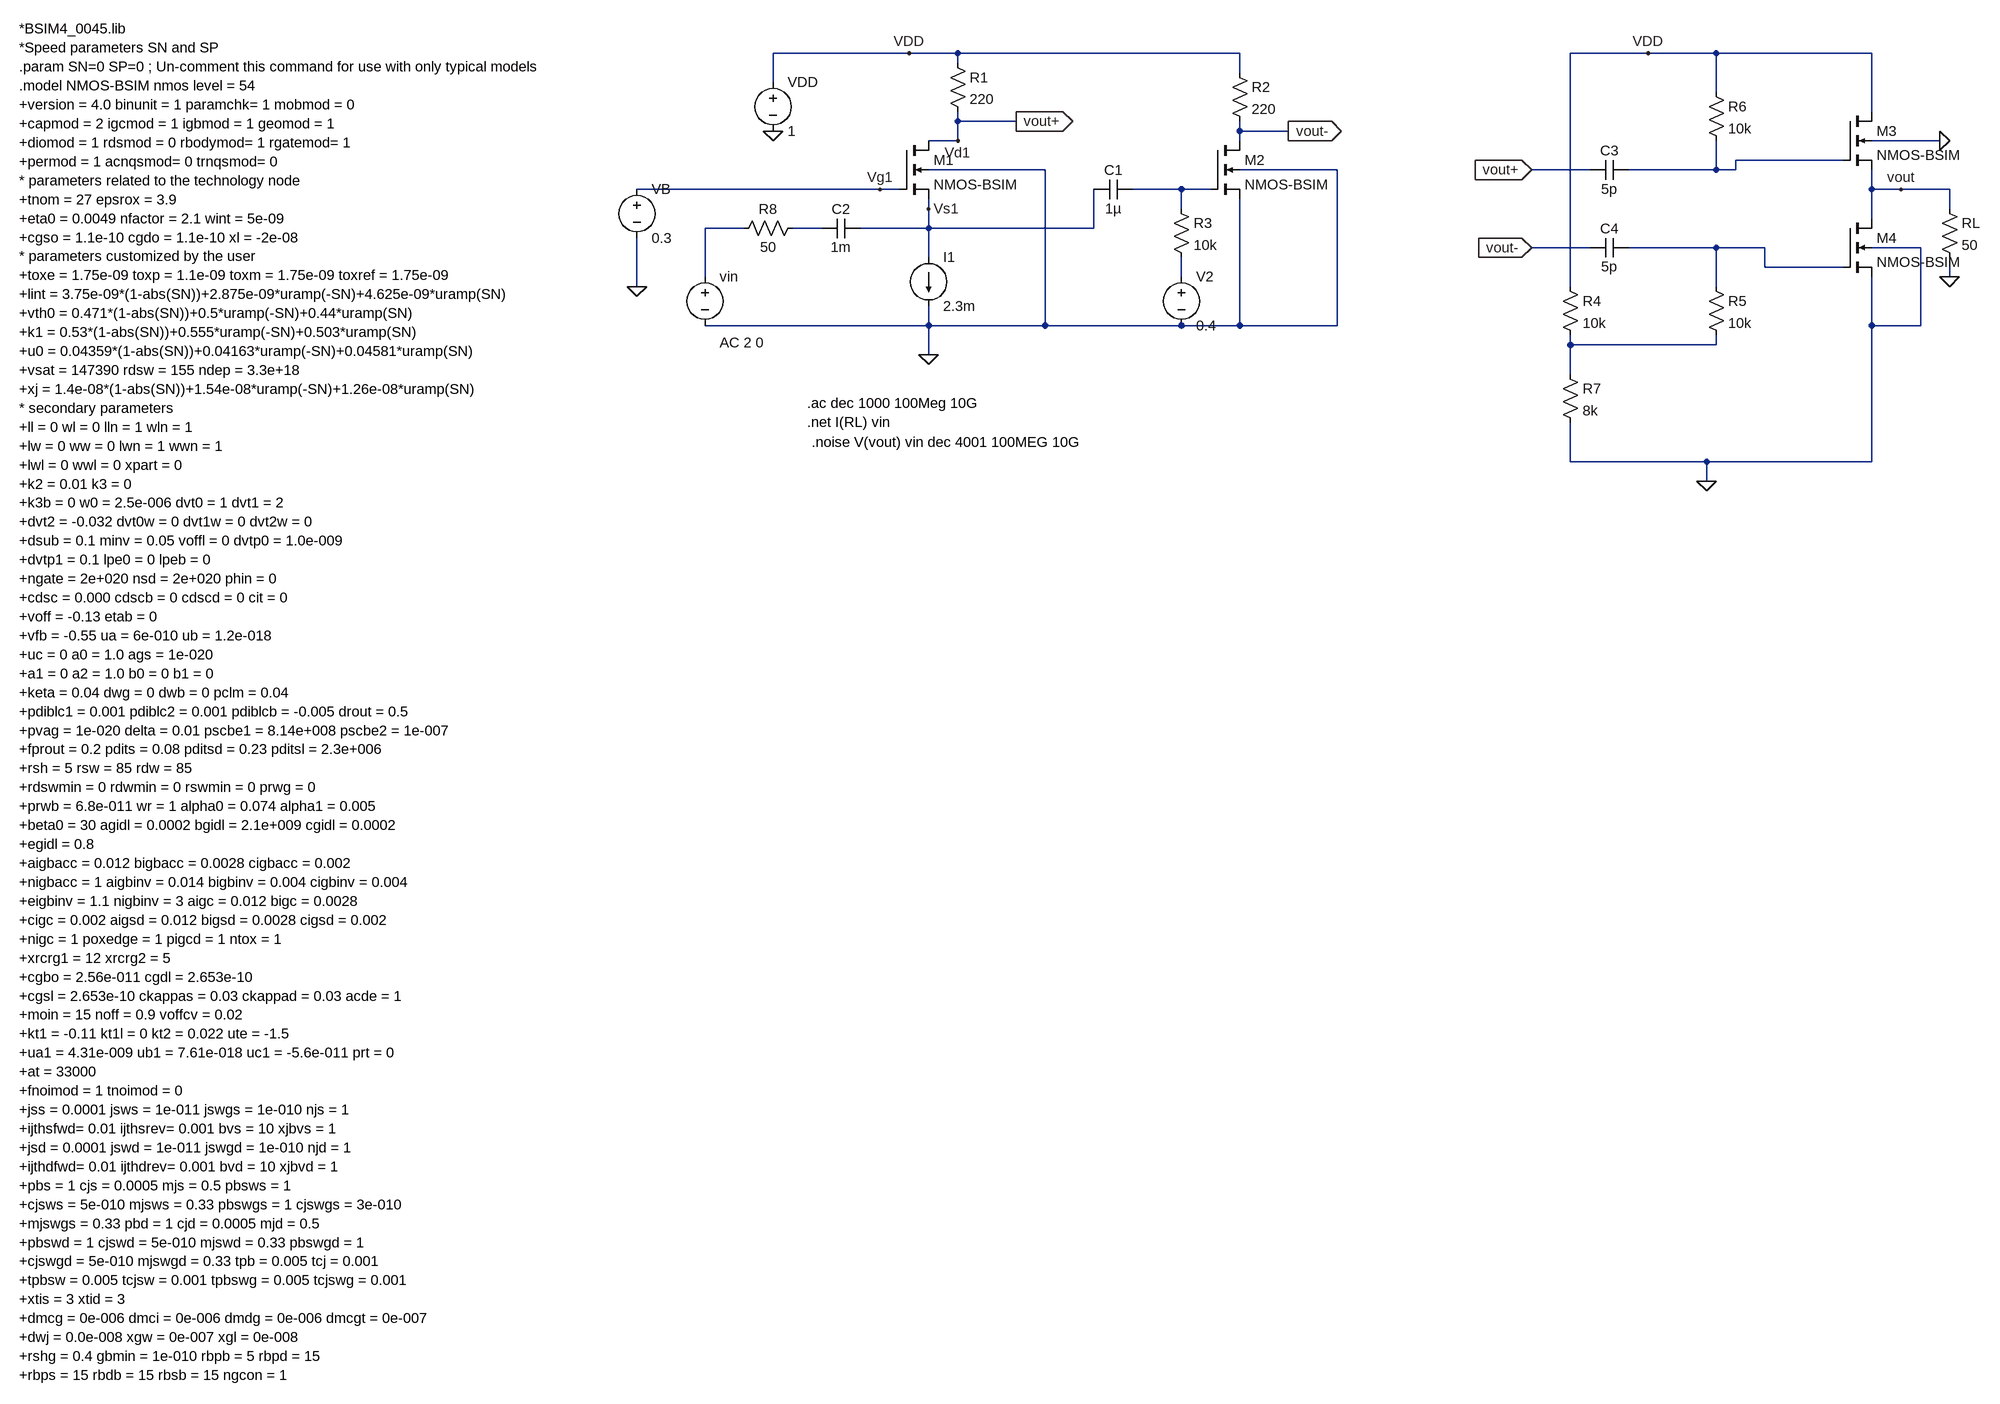
[diagram p0: schematic 3x45nmN.asc]
3x45nmN.asc, the LTspice schematic file:
Version 4
SHEET 1 2000 1996
WIRE 224 32 0 32
WIRE 304 32 224 32
WIRE 768 32 304 32
WIRE 1440 32 1312 32
WIRE 1552 32 1440 32
WIRE 1808 32 1552 32
WIRE 304 48 304 32
WIRE 768 64 768 32
WIRE 0 80 0 32
WIRE 1552 96 1552 32
WIRE 1808 128 1808 32
WIRE 304 144 304 128
WIRE 400 144 304 144
WIRE 768 160 768 144
WIRE 848 160 768 160
WIRE 304 176 304 144
WIRE 304 176 256 176
WIRE 768 176 768 160
WIRE 1920 176 1808 176
WIRE 1760 208 1584 208
WIRE 448 224 256 224
WIRE 928 224 768 224
WIRE 1344 224 1248 224
WIRE 1552 224 1552 176
WIRE 1552 224 1408 224
WIRE 1584 224 1584 208
WIRE 1584 224 1552 224
WIRE 176 256 -224 256
WIRE 208 256 176 256
WIRE 672 256 592 256
WIRE 720 256 672 256
WIRE 1808 256 1808 224
WIRE 1856 256 1808 256
WIRE 1936 256 1856 256
WIRE 256 288 256 272
WIRE 672 288 672 256
WIRE 1936 288 1936 256
WIRE 1808 304 1808 256
WIRE -48 320 -112 320
WIRE 80 320 32 320
WIRE 256 320 256 288
WIRE 256 320 144 320
WIRE 528 320 528 256
WIRE 528 320 256 320
WIRE 1344 352 1248 352
WIRE 1552 352 1408 352
WIRE 1632 352 1552 352
WIRE 1888 352 1808 352
WIRE 256 368 256 320
WIRE 1632 384 1632 352
WIRE 1760 384 1632 384
WIRE -112 400 -112 320
WIRE 672 400 672 368
WIRE 1936 400 1936 368
WIRE -224 416 -224 336
WIRE 1312 416 1312 32
WIRE 1552 416 1552 352
WIRE 256 480 256 448
WIRE 256 480 -112 480
WIRE 448 480 448 224
WIRE 448 480 256 480
WIRE 672 480 448 480
WIRE 768 480 768 272
WIRE 768 480 672 480
WIRE 928 480 928 224
WIRE 928 480 768 480
WIRE 1808 480 1808 400
WIRE 1888 480 1888 352
WIRE 1888 480 1808 480
WIRE 1312 512 1312 496
WIRE 1552 512 1552 496
WIRE 1552 512 1312 512
WIRE 256 528 256 480
WIRE 1312 560 1312 512
WIRE 1312 704 1312 640
WIRE 1536 704 1312 704
WIRE 1808 704 1808 480
WIRE 1808 704 1536 704
WIRE 1536 736 1536 704
FLAG 0 160 0
FLAG 224 32 VDD
FLAG 304 176 Vd1
FLAG -224 416 0
FLAG 256 288 Vs1
FLAG 176 256 Vg1
FLAG 256 528 0
FLAG 400 144 vout+
IOPIN 400 144 Out
FLAG 848 160 vout-
IOPIN 848 160 Out
FLAG 1248 224 vout+
IOPIN 1248 224 In
FLAG 1248 352 vout-
IOPIN 1248 352 In
FLAG 1536 736 0
FLAG 1936 400 0
FLAG 1920 176 0
FLAG 1856 256 vout
FLAG 1440 32 VDD
SYMBOL voltage 0 64 R0
SYMATTR InstName VDD
SYMATTR Value 1
SYMBOL res 288 32 R0
SYMATTR InstName R1
SYMATTR Value 220
SYMBOL voltage -224 240 R0
WINDOW 123 0 0 Left 0
WINDOW 39 0 0 Left 0
SYMATTR InstName VB
SYMATTR Value 0.3
SYMBOL current 256 368 R0
WINDOW 123 0 0 Left 0
WINDOW 39 0 0 Left 0
SYMATTR InstName I1
SYMATTR Value 2.3m
SYMBOL nmos4 208 176 R0
SYMATTR InstName M1
SYMATTR Value NMOS-BSIM
SYMATTR Value2 l=135n w=2u m=10
SYMBOL voltage -112 384 R0
WINDOW 123 24 124 Left 2
WINDOW 39 24 152 Left 2
SYMATTR Value2 AC 2 0
SYMATTR InstName vin
SYMATTR Value ""
SYMBOL nmos4 720 176 R0
SYMATTR InstName M2
SYMATTR Value NMOS-BSIM
SYMATTR Value2 l=135n w=40.5u m=10
SYMBOL res 752 48 R0
SYMATTR InstName R2
SYMATTR Value 220
SYMBOL cap 592 240 R90
WINDOW 0 0 32 VBottom 2
WINDOW 3 32 32 VTop 2
SYMATTR InstName C1
SYMATTR Value 1µ
SYMBOL res 656 272 R0
SYMATTR InstName R3
SYMATTR Value 10k
SYMBOL voltage 672 384 R0
WINDOW 123 0 0 Left 0
WINDOW 39 0 0 Left 0
SYMATTR InstName V2
SYMATTR Value 0.4
SYMBOL cap 144 304 R90
WINDOW 0 0 32 VBottom 2
WINDOW 3 32 32 VTop 2
SYMATTR InstName C2
SYMATTR Value 1m
SYMBOL cap 1408 208 R90
WINDOW 0 0 32 VBottom 2
WINDOW 3 32 32 VTop 2
SYMATTR InstName C3
SYMATTR Value 5p
SYMBOL cap 1408 336 R90
WINDOW 0 0 32 VBottom 2
WINDOW 3 32 32 VTop 2
SYMATTR InstName C4
SYMATTR Value 5p
SYMBOL res 1296 400 R0
SYMATTR InstName R4
SYMATTR Value 10k
SYMBOL res 1536 400 R0
SYMATTR InstName R5
SYMATTR Value 10k
SYMBOL res 1536 80 R0
SYMATTR InstName R6
SYMATTR Value 10k
SYMBOL res 1296 544 R0
SYMATTR InstName R7
SYMATTR Value 8k
SYMBOL res 1920 272 R0
SYMATTR InstName RL
SYMATTR Value 50
SYMBOL nmos4 1760 128 R0
SYMATTR InstName M3
SYMATTR Value NMOS-BSIM
SYMATTR Value2 l=45n w=5.2u
SYMBOL nmos4 1760 304 R0
SYMATTR InstName M4
SYMATTR Value NMOS-BSIM
SYMATTR Value2 l=45n w=55u
SYMBOL res 48 304 R90
WINDOW 0 0 56 VBottom 2
WINDOW 3 32 56 VTop 2
SYMATTR InstName R8
SYMATTR Value 50
TEXT -1240 -8 Left 2 !*BSIM4_0045.lib\n*Speed parameters SN and SP\n.param SN=0 SP=0 ; Un-comment this command for use with only typical models\n.model NMOS-BSIM nmos level = 54\n+version = 4.0 binunit = 1 paramchk= 1 mobmod = 0\n+capmod = 2 igcmod = 1 igbmod = 1 geomod = 1\n+diomod = 1 rdsmod = 0 rbodymod= 1 rgatemod= 1\n+permod = 1 acnqsmod= 0 trnqsmod= 0\n* parameters related to the technology node\n+tnom = 27 epsrox = 3.9\n+eta0 = 0.0049 nfactor = 2.1 wint = 5e-09\n+cgso = 1.1e-10 cgdo = 1.1e-10 xl = -2e-08\n* parameters customized by the user\n+toxe = 1.75e-09 toxp = 1.1e-09 toxm = 1.75e-09 toxref = 1.75e-09\n+lint = 3.75e-09*(1-abs(SN))+2.875e-09*uramp(-SN)+4.625e-09*uramp(SN)\n+vth0 = 0.471*(1-abs(SN))+0.5*uramp(-SN)+0.44*uramp(SN)\n+k1 = 0.53*(1-abs(SN))+0.555*uramp(-SN)+0.503*uramp(SN)\n+u0 = 0.04359*(1-abs(SN))+0.04163*uramp(-SN)+0.04581*uramp(SN)\n+vsat = 147390 rdsw = 155 ndep = 3.3e+18\n+xj = 1.4e-08*(1-abs(SN))+1.54e-08*uramp(-SN)+1.26e-08*uramp(SN)\n* secondary parameters\n+ll = 0 wl = 0 lln = 1 wln = 1\n+lw = 0 ww = 0 lwn = 1 wwn = 1\n+lwl = 0 wwl = 0 xpart = 0\n+k2 = 0.01 k3 = 0\n+k3b = 0 w0 = 2.5e-006 dvt0 = 1 dvt1 = 2\n+dvt2 = -0.032 dvt0w = 0 dvt1w = 0 dvt2w = 0\n+dsub = 0.1 minv = 0.05 voffl = 0 dvtp0 = 1.0e-009\n+dvtp1 = 0.1 lpe0 = 0 lpeb = 0\n+ngate = 2e+020 nsd = 2e+020 phin = 0\n+cdsc = 0.000 cdscb = 0 cdscd = 0 cit = 0\n+voff = -0.13 etab = 0\n+vfb = -0.55 ua = 6e-010 ub = 1.2e-018\n+uc = 0 a0 = 1.0 ags = 1e-020\n+a1 = 0 a2 = 1.0 b0 = 0 b1 = 0\n+keta = 0.04 dwg = 0 dwb = 0 pclm = 0.04\n+pdiblc1 = 0.001 pdiblc2 = 0.001 pdiblcb = -0.005 drout = 0.5\n+pvag = 1e-020 delta = 0.01 pscbe1 = 8.14e+008 pscbe2 = 1e-007\n+fprout = 0.2 pdits = 0.08 pditsd = 0.23 pditsl = 2.3e+006\n+rsh = 5 rsw = 85 rdw = 85\n+rdswmin = 0 rdwmin = 0 rswmin = 0 prwg = 0\n+prwb = 6.8e-011 wr = 1 alpha0 = 0.074 alpha1 = 0.005\n+beta0 = 30 agidl = 0.0002 bgidl = 2.1e+009 cgidl = 0.0002\n+egidl = 0.8\n+aigbacc = 0.012 bigbacc = 0.0028 cigbacc = 0.002\n+nigbacc = 1 aigbinv = 0.014 bigbinv = 0.004 cigbinv = 0.004\n+eigbinv = 1.1 nigbinv = 3 aigc = 0.012 bigc = 0.0028\n+cigc = 0.002 aigsd = 0.012 bigsd = 0.0028 cigsd = 0.002\n+nigc = 1 poxedge = 1 pigcd = 1 ntox = 1\n+xrcrg1 = 12 xrcrg2 = 5\n+cgbo = 2.56e-011 cgdl = 2.653e-10\n+cgsl = 2.653e-10 ckappas = 0.03 ckappad = 0.03 acde = 1\n+moin = 15 noff = 0.9 voffcv = 0.02\n+kt1 = -0.11 kt1l = 0 kt2 = 0.022 ute = -1.5\n+ua1 = 4.31e-009 ub1 = 7.61e-018 uc1 = -5.6e-011 prt = 0\n+at = 33000\n+fnoimod = 1 tnoimod = 0\n+jss = 0.0001 jsws = 1e-011 jswgs = 1e-010 njs = 1\n+ijthsfwd= 0.01 ijthsrev= 0.001 bvs = 10 xjbvs = 1\n+jsd = 0.0001 jswd = 1e-011 jswgd = 1e-010 njd = 1\n+ijthdfwd= 0.01 ijthdrev= 0.001 bvd = 10 xjbvd = 1\n+pbs = 1 cjs = 0.0005 mjs = 0.5 pbsws = 1\n+cjsws = 5e-010 mjsws = 0.33 pbswgs = 1 cjswgs = 3e-010\n+mjswgs = 0.33 pbd = 1 cjd = 0.0005 mjd = 0.5\n+pbswd = 1 cjswd = 5e-010 mjswd = 0.33 pbswgd = 1\n+cjswgd = 5e-010 mjswgd = 0.33 tpb = 0.005 tcj = 0.001\n+tpbsw = 0.005 tcjsw = 0.001 tpbswg = 0.005 tcjswg = 0.001\n+xtis = 3 xtid = 3\n+dmcg = 0e-006 dmci = 0e-006 dmdg = 0e-006 dmcgt = 0e-007\n+dwj = 0.0e-008 xgw = 0e-007 xgl = 0e-008\n+rshg = 0.4 gbmin = 1e-010 rbpb = 5 rbpd = 15\n+rbps = 15 rbdb = 15 rbsb = 15 ngcon = 1
TEXT 56 608 Left 2 !.ac dec 1000 100Meg 10G\n.net I(RL) vin
TEXT 64 672 Left 2 !.noise V(vout) vin dec 4001 100MEG 10G

The netlist it stands for:
* 3x45nmN.asc
VDD VDD 0 1
R1 VDD vout+ 220
VB Vg1 0 0.3
I1 Vs1 0 2.3m
M1 vout+ Vg1 Vs1 0 NMOS-BSIM l=135n w=2u m=10
vin N003 0 AC 2 0
M2 vout- N002 0 0 NMOS-BSIM l=135n w=40.5u m=10
R2 VDD vout- 220
C1 N002 Vs1 1µ
R3 N002 N006 10k
V2 N006 0 0.4
C2 Vs1 N004 1m
C3 N001 vout+ 5p
C4 N005 vout- 5p
R4 VDD N007 10k
R5 N005 N007 10k
R6 VDD N001 10k
R7 N007 0 8k
RL vout 0 50
M3 VDD N001 vout 0 NMOS-BSIM l=45n w=5.2u
M4 vout N005 0 0 NMOS-BSIM l=45n w=55u
R8 N004 N003 50
.model NMOS NMOS
.model PMOS PMOS
.lib standard.mos
*BSIM4_0045.lib
*Speed parameters SN and SP
.param SN=0 SP=0 ; Un-comment this command for use with only typical models
.model NMOS-BSIM nmos level = 54
+version = 4.0 binunit = 1 paramchk= 1 mobmod = 0
+capmod = 2 igcmod = 1 igbmod = 1 geomod = 1
+diomod = 1 rdsmod = 0 rbodymod= 1 rgatemod= 1
+permod = 1 acnqsmod= 0 trnqsmod= 0
* parameters related to the technology node
+tnom = 27 epsrox = 3.9
+eta0 = 0.0049 nfactor = 2.1 wint = 5e-09
+cgso = 1.1e-10 cgdo = 1.1e-10 xl = -2e-08
* parameters customized by the user
+toxe = 1.75e-09 toxp = 1.1e-09 toxm = 1.75e-09 toxref = 1.75e-09
+lint = 3.75e-09*(1-abs(SN))+2.875e-09*uramp(-SN)+4.625e-09*uramp(SN)
+vth0 = 0.471*(1-abs(SN))+0.5*uramp(-SN)+0.44*uramp(SN)
+k1 = 0.53*(1-abs(SN))+0.555*uramp(-SN)+0.503*uramp(SN)
+u0 = 0.04359*(1-abs(SN))+0.04163*uramp(-SN)+0.04581*uramp(SN)
+vsat = 147390 rdsw = 155 ndep = 3.3e+18
+xj = 1.4e-08*(1-abs(SN))+1.54e-08*uramp(-SN)+1.26e-08*uramp(SN)
* secondary parameters
+ll = 0 wl = 0 lln = 1 wln = 1
+lw = 0 ww = 0 lwn = 1 wwn = 1
+lwl = 0 wwl = 0 xpart = 0
+k2 = 0.01 k3 = 0
+k3b = 0 w0 = 2.5e-006 dvt0 = 1 dvt1 = 2
+dvt2 = -0.032 dvt0w = 0 dvt1w = 0 dvt2w = 0
+dsub = 0.1 minv = 0.05 voffl = 0 dvtp0 = 1.0e-009
+dvtp1 = 0.1 lpe0 = 0 lpeb = 0
+ngate = 2e+020 nsd = 2e+020 phin = 0
+cdsc = 0.000 cdscb = 0 cdscd = 0 cit = 0
+voff = -0.13 etab = 0
+vfb = -0.55 ua = 6e-010 ub = 1.2e-018
+uc = 0 a0 = 1.0 ags = 1e-020
+a1 = 0 a2 = 1.0 b0 = 0 b1 = 0
+keta = 0.04 dwg = 0 dwb = 0 pclm = 0.04
+pdiblc1 = 0.001 pdiblc2 = 0.001 pdiblcb = -0.005 drout = 0.5
+pvag = 1e-020 delta = 0.01 pscbe1 = 8.14e+008 pscbe2 = 1e-007
+fprout = 0.2 pdits = 0.08 pditsd = 0.23 pditsl = 2.3e+006
+rsh = 5 rsw = 85 rdw = 85
+rdswmin = 0 rdwmin = 0 rswmin = 0 prwg = 0
+prwb = 6.8e-011 wr = 1 alpha0 = 0.074 alpha1 = 0.005
+beta0 = 30 agidl = 0.0002 bgidl = 2.1e+009 cgidl = 0.0002
+egidl = 0.8
+aigbacc = 0.012 bigbacc = 0.0028 cigbacc = 0.002
+nigbacc = 1 aigbinv = 0.014 bigbinv = 0.004 cigbinv = 0.004
+eigbinv = 1.1 nigbinv = 3 aigc = 0.012 bigc = 0.0028
+cigc = 0.002 aigsd = 0.012 bigsd = 0.0028 cigsd = 0.002
+nigc = 1 poxedge = 1 pigcd = 1 ntox = 1
+xrcrg1 = 12 xrcrg2 = 5
+cgbo = 2.56e-011 cgdl = 2.653e-10
+cgsl = 2.653e-10 ckappas = 0.03 ckappad = 0.03 acde = 1
+moin = 15 noff = 0.9 voffcv = 0.02
+kt1 = -0.11 kt1l = 0 kt2 = 0.022 ute = -1.5
+ua1 = 4.31e-009 ub1 = 7.61e-018 uc1 = -5.6e-011 prt = 0
+at = 33000
+fnoimod = 1 tnoimod = 0
+jss = 0.0001 jsws = 1e-011 jswgs = 1e-010 njs = 1
+ijthsfwd= 0.01 ijthsrev= 0.001 bvs = 10 xjbvs = 1
+jsd = 0.0001 jswd = 1e-011 jswgd = 1e-010 njd = 1
+ijthdfwd= 0.01 ijthdrev= 0.001 bvd = 10 xjbvd = 1
+pbs = 1 cjs = 0.0005 mjs = 0.5 pbsws = 1
+cjsws = 5e-010 mjsws = 0.33 pbswgs = 1 cjswgs = 3e-010
+mjswgs = 0.33 pbd = 1 cjd = 0.0005 mjd = 0.5
+pbswd = 1 cjswd = 5e-010 mjswd = 0.33 pbswgd = 1
+cjswgd = 5e-010 mjswgd = 0.33 tpb = 0.005 tcj = 0.001
+tpbsw = 0.005 tcjsw = 0.001 tpbswg = 0.005 tcjswg = 0.001
+xtis = 3 xtid = 3
+dmcg = 0e-006 dmci = 0e-006 dmdg = 0e-006 dmcgt = 0e-007
+dwj = 0.0e-008 xgw = 0e-007 xgl = 0e-008
+rshg = 0.4 gbmin = 1e-010 rbpb = 5 rbpd = 15
+rbps = 15 rbdb = 15 rbsb = 15 ngcon = 1
.ac dec 1000 100Meg 10G
.net I(RL) vin
.noise V(vout) vin dec 4001 100MEG 10G
.backanno
.end